# Altium schematic sheet MCU.SchDoc: Termodeep- MCU
size A4; Proyect DSD: TermoDeep; Version: V 1.0  Rev A
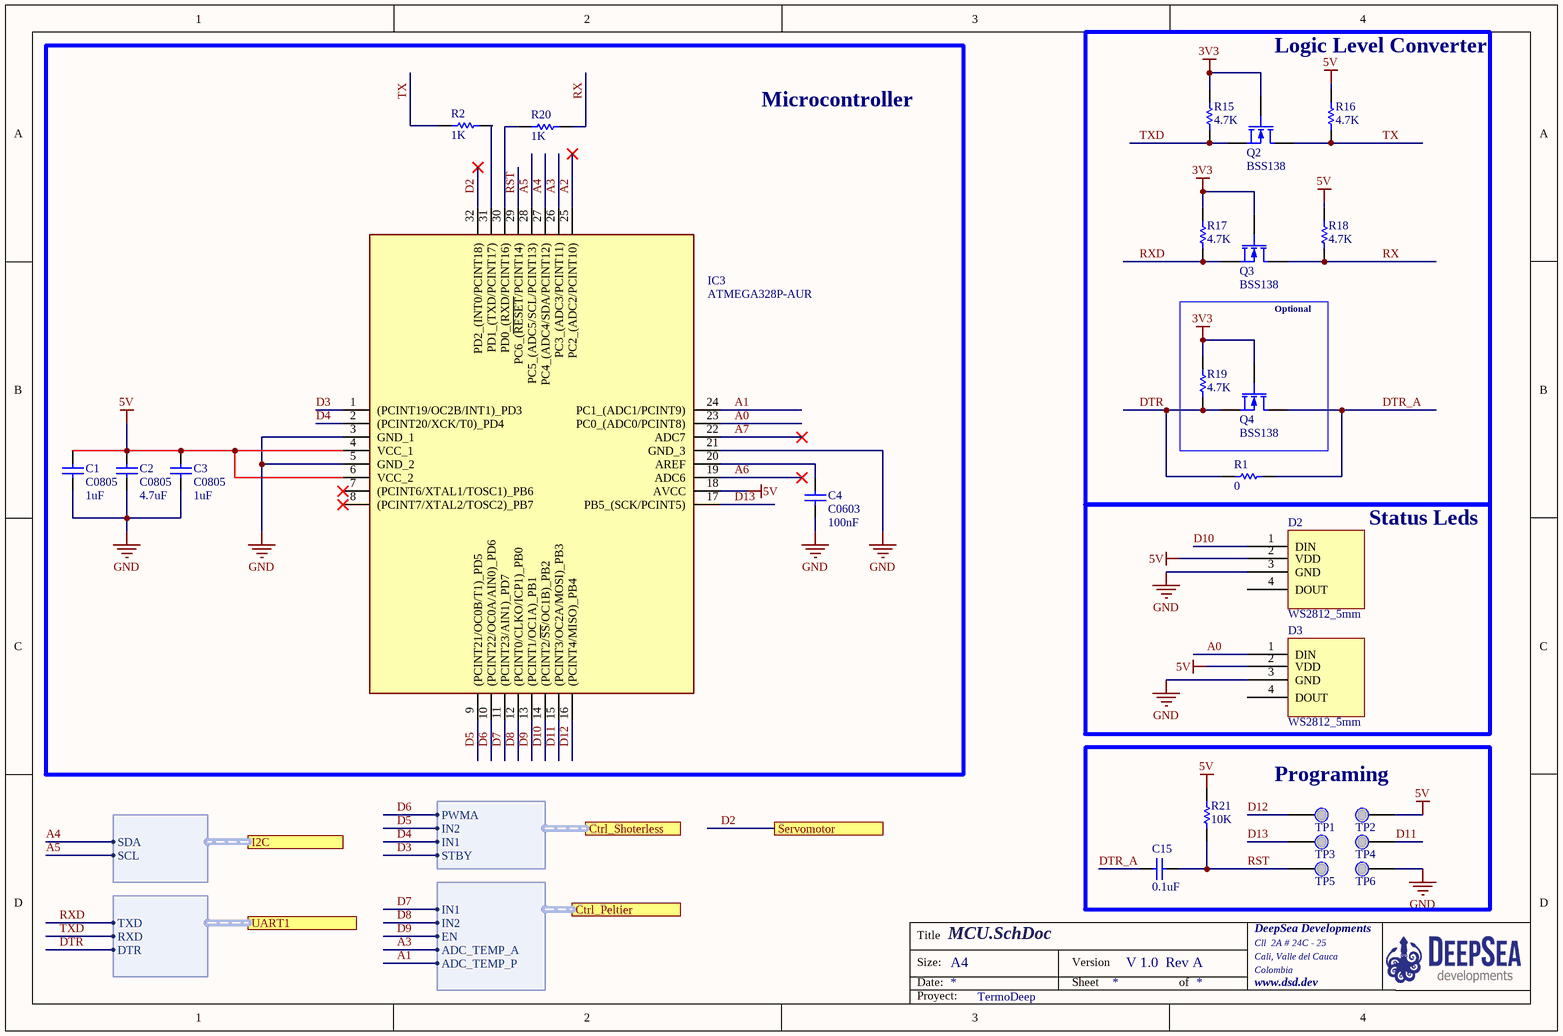
[diagram p0: MCU.SchDoc]

## Parts
C1  C0805  value 1uF  [0805]
C2  C0805  value 4.7uF  [0805]
C3  C0805  value 1uF  [0805]
C4  C0603  value 100nF  [CP0603_N]
C15  0.1uF  [C0603_L]
D2  WS2812_5mm  [Ws2812_5mm]
D3  WS2812_5mm  [Ws2812_5mm]
IC3  ATMEGA328P-AUR  [QFP80P900X900X120-32N]
Q2  BSS138  [SOT23]
Q3  BSS138  [SOT23]
Q4  BSS138  [SOT23]
R1  0  [R0603_N]
R2  1K  [R0603_N]
R15  4.7K  [R0603_N]
R16  4.7K  [R0603_N]
R17  4.7K  [R0603_N]
R18  4.7K  [R0603_N]
R19  4.7K  [R0603_N]
R20  1K  [R0603_N]
R21  10K  [R0603_N]
TP1  Test_Point  [TestPoint]  (value not drawn)
TP2  Test_Point  [TestPoint]  (value not drawn)
TP3  Test_Point  [TestPoint]  (value not drawn)
TP4  Test_Point  [TestPoint]  (value not drawn)
TP5  Test_Point  [TestPoint]  (value not drawn)
TP6  Test_Point  [TestPoint]  (value not drawn)

## Blocks framed on the sheet
Microcontroller: C1-C4 IC3 R2 R20
Logic Level Converter: Q2 Q3 R1 R15-R18
Optional: Q4 R19
Status Leds: D2 D3
Programing: C15 R21 TP1-TP6

## Ports
Ctrl_Peltier (harness Ctrl_Peltier), Ctrl_Shoterless (harness Ctrl_Shoterless), I2C (harness I2C), Servomotor, UART1 (harness UART1)

## Harnesses
I2C: SDA, SCL
Ctrl_Peltier: IN1, IN2, EN, ADC_TEMP_A, ADC_TEMP_P
Ctrl_Shoterless: PWMA, IN2, IN1, STBY
UART1: TXD, RXD, DTR

## Nets
3V3: Q2.3(G) Q3.3(G) Q4.3(G) R15.1 R17.1 R19.1
5V: C1.2 C2.2 C3.2 D2.2(VDD) D3.2(VDD) IC3.4(VCC_1) IC3.6(VCC_2) IC3.18(AVCC) R16.1 R18.1 R21.1 TP2.0(TP)
GND: C1.1 C2.1 C3.1 C4.1 D2.3(GND) D3.3(GND) IC3.3(GND_1) IC3.5(GND_2) IC3.21(GND_3) TP6.0(TP)
A0: D3.1(DIN) IC3.23(PC0_(ADC0/PCINT8))
A1: IC3.24(PC1_(ADC1/PCINT9)) ; port Ctrl_Peltier.ADC_TEMP_P
A2: IC3.25(PC2_(ADC2/PCINT10))
A3: IC3.26(PC3_(ADC3/PCINT11)) ; port Ctrl_Peltier.ADC_TEMP_A
A4: IC3.27(PC4_(ADC4/SDA/PCINT12)) ; port I2C.SDA
A5: IC3.28(PC5_(ADC5/SCL/PCINT13)) ; port I2C.SCL
A6: IC3.19(ADC6)
A7: IC3.22(ADC7)
D2: IC3.32(PD2_(INT0/PCINT18)) ; port Servomotor
D3: IC3.1((PCINT19/OC2B/INT1)_PD3) ; port Ctrl_Shoterless.STBY
D4: IC3.2((PCINT20/XCK/T0)_PD4) ; port Ctrl_Shoterless.IN1
D5: IC3.9((PCINT21/OC0B/T1)_PD5) ; port Ctrl_Shoterless.IN2
D6: IC3.10((PCINT22/OC0A/AIN0)_PD6) ; port Ctrl_Shoterless.PWMA
D7: IC3.11((PCINT23/AIN1)_PD7) ; port Ctrl_Peltier.IN1
D8: IC3.12((PCINT0/CLKO/ICP1)_PB0) ; port Ctrl_Peltier.IN2
D9: IC3.13((PCINT1/OC1A)_PB1) ; port Ctrl_Peltier.EN
D10: D2.1(DIN) IC3.14((PCINT2/~{SS}/OC1B)_PB2)
D11: IC3.15((PCINT3/OC2A/MOSI)_PB3) TP4.0(TP)
D12: IC3.16((PCINT4/MISO)_PB4) TP1.0(TP)
D13: IC3.17(PB5_(SCK/PCINT5)) TP3.0(TP)
DTR: Q4.2(S) R1.1 R19.2 ; port UART1.DTR
DTR_A: C15.1 Q4.1(D) R1.2
RST: C15.2 IC3.29(PC6_(~{RESET}/PCINT14)) R21.2 TP5.0(TP)
RX: Q3.1(D) R18.2 R20.2
RXD: Q3.2(S) R17.2 ; port UART1.TXD
TX: Q2.1(D) R2.1 R16.2
TXD: Q2.2(S) R15.2 ; port UART1.RXD
NetC4_2: C4.2 IC3.20(AREF)
NetIC3_30: IC3.30(PD0_(RXD/PCINT16)) R20.1
NetIC3_31: IC3.31(PD1_(TXD/PCINT17)) R2.2

Not connected (* = marked no-connect by the designer): D2 4(DOUT); D3 4(DOUT); IC3 7((PCINT6/XTAL1/TOSC1)_PB6)* 8((PCINT7/XTAL2/TOSC2)_PB7)*

## Notes on the sheet
- Title
- Size:
- Date:
- A4
- Version
- Sheet
- of
- DeepSea Developments
- Cll  2A # 24C - 25
- Cali, Valle del Cauca
- Colombia
- www.dsd.dev
- Proyect:

## Library data of the parts
C1-C4 = C0805: Ceramic Chip Capacitor - Standard; Note: Footprint corresponds to dimensions for bulk cassette packaging. This case size has tightened tolerances.; Published: 17-Jul-2002; LatestRevisionDate: 19-Mar-2004; LatestRevisionNote: Silkscreen size reduced.; DatasheetDocument: Mar-2001; PackageDocument: Mar-2001; PackageReference: 0805; Publisher: Altium Limited; Code_JEITA: 0805; Code_IPC: 2012[0805]; ComponentLink1Description: Manufacturer Link; ComponentLink1URL: http://www.kemet.com/; ComponentLink2Description: Datasheet; ComponentLink2URL: http://www.kemet.com/kemet/web/homepage/kechome.nsf/vapubfilesname/F3102TA.pdf/$file/F3102TA.pdf
C15 = C_SMD: Value: 0.1uF
IC3 = ATMEGA328-AUR: Integrated Circuit; Manufacturer_Name: Microchip; Datasheet Link: https://componentsearchengine.com/Datasheets/1/ATMEGA328-AUR.pdf; Height: 1.2mm; Manufacturer_Part_Number: ATMEGA328-AUR; Mouser Part Number: 556-ATMEGA328-AUR; Mouser Price/Stock: https://www.mouser.co.uk/ProductDetail/Microchip-Technology-Atmel/ATMEGA328-AUR?qs=lwdSMh1%2FoYLfe%252B5OKFEFrw%3D%3D; RS Part Number: 1773199P; RS Price/Stock: http://uk.rs-online.com/web/p/products/1773199P
Q2-Q4 = BSS138: N-Channel Enhancement Mode Vertical DMOS FET; Published: 17-Dec-2003; DatasheetVersion: Mar-96; PackageVersion: 1996; PackageReference: SOT23; Publisher: Altium Limited; PackageDescription: SOT-23; 3 Leads; Body 3.1 x 2.5 mm, inc. leads (LxW max), Alternate Lead Configuration; ComponentLink1Description: Manufacturer Link; ComponentLink1URL: http://www.zetex.com/; ComponentLink2Description: Datasheet; ComponentLink2URL: www.zetex.com/3.0/pdf/BSS138.pdf
R1 R2 R15-R21 = R_SMD
  R1: Value: 0
  R2 R20: Value: 1K
  R15-R19: Value: 4.7K
  R21: Value: 10K